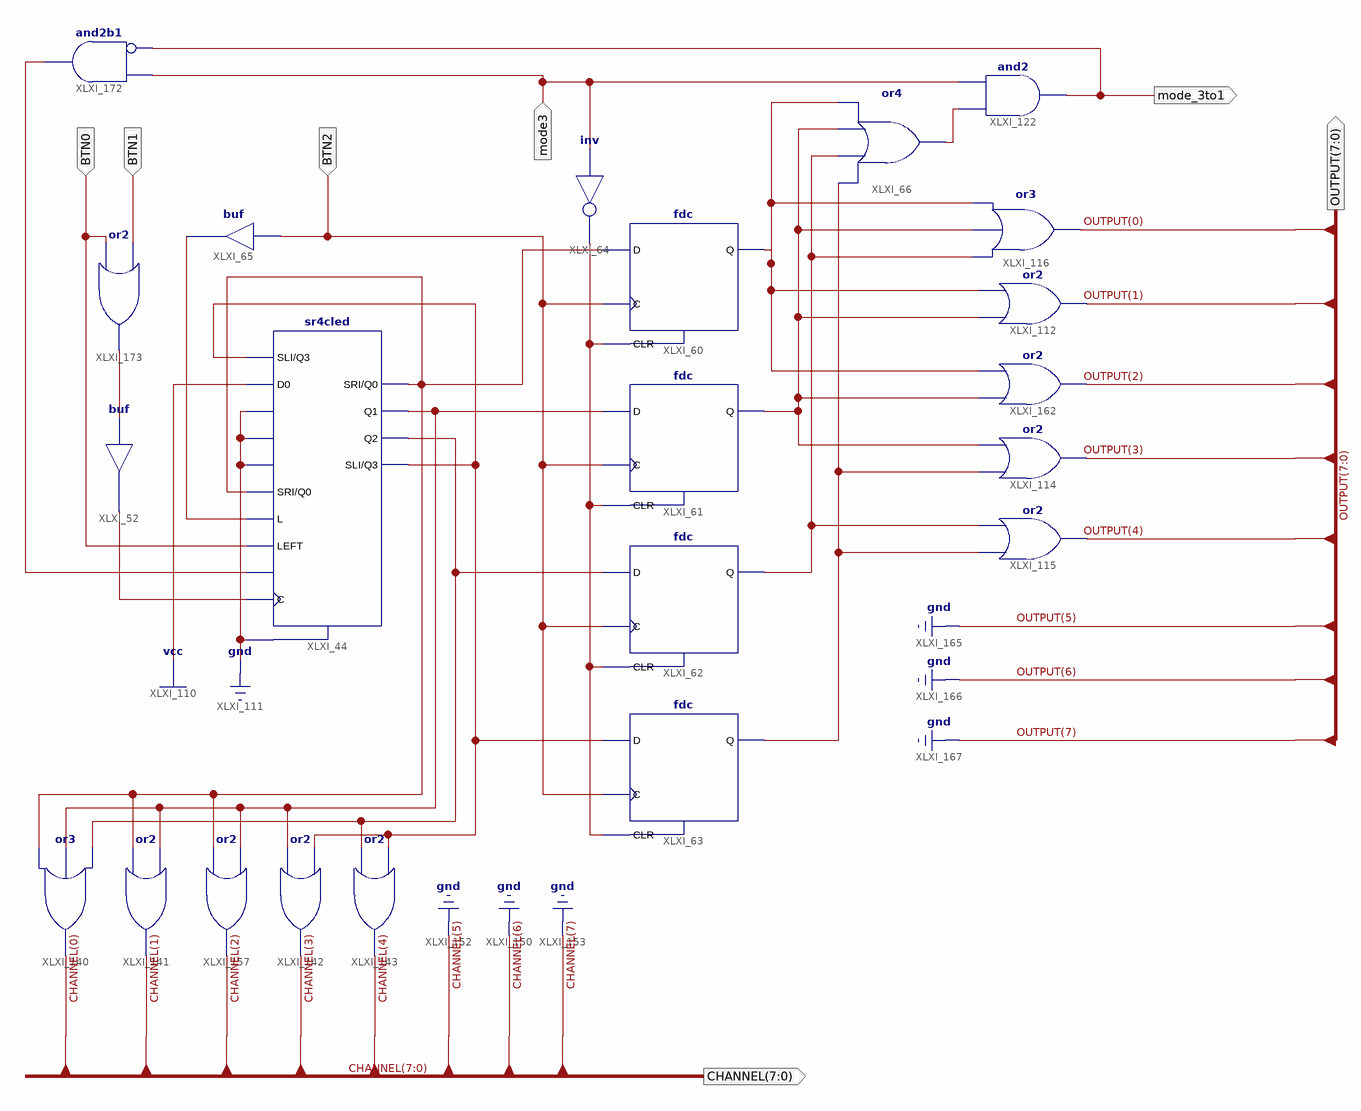
[diagram p0: schematic sheet 1]
// Xilinx ISE schematic third.sch (spartan3) as structural Verilog: 22 symbols, 8 ports
module third (
  input  XLXN_111,
  input  BTN2,
  input  BTN0,
  input  mode3,
  input  BTN1,
  output mode_3to1,
  output [7:0] CHANNEL,
  output [7:0] OUTPUT
);

  wire XLXN_76, XLXN_88, XLXN_122, XLXN_123, XLXN_124, XLXN_125, XLXN_164, XLXN_166, XLXN_170, XLXN_241,
       XLXN_348, XLXN_371;

  buf XLXI_52 (XLXN_88, XLXN_348);
  sr4cled XLXI_44 (
    .C(XLXN_88), .CE(1'b0), .CLR(1'b0), .D0(1'b1), .D1(1'b0), .D2(1'b0), .D3(1'b0), .L(XLXN_371),
    .LEFT(BTN0), .SLI(XLXN_76), .SRI(XLXN_164), .Q0(XLXN_164), .Q1(XLXN_111), .Q2(XLXN_170), .Q3(XLXN_76));
  buf XLXI_65 (XLXN_371, BTN2);
  or XLXI_66 (XLXN_241, XLXN_125, XLXN_124, XLXN_123, XLXN_122);
  not XLXI_64 (XLXN_166, mode3);
  and XLXI_122 (mode_3to1, XLXN_241, mode3);
  or XLXI_116 (OUTPUT[0], XLXN_124, XLXN_123, XLXN_122);
  or XLXI_112 (OUTPUT[1], XLXN_123, XLXN_122);
  fdc XLXI_60 (.C(BTN2), .CLR(XLXN_166), .D(XLXN_164), .Q(XLXN_122));
  fdc XLXI_61 (.C(BTN2), .CLR(XLXN_166), .D(XLXN_111), .Q(XLXN_123));
  fdc XLXI_62 (.C(BTN2), .CLR(XLXN_166), .D(XLXN_170), .Q(XLXN_124));
  fdc XLXI_63 (.C(BTN2), .CLR(XLXN_166), .D(XLXN_76), .Q(XLXN_125));
  or XLXI_140 (CHANNEL[0], XLXN_164, XLXN_111, XLXN_170);
  or XLXI_141 (CHANNEL[1], XLXN_164, XLXN_111);
  or XLXI_143 (CHANNEL[4], XLXN_170, XLXN_76);
  or XLXI_142 (CHANNEL[3], XLXN_111, XLXN_76);
  or XLXI_157 (CHANNEL[2], XLXN_164, XLXN_111);
  or XLXI_162 (OUTPUT[2], XLXN_123, XLXN_122);
  or XLXI_114 (OUTPUT[3], XLXN_125, XLXN_123);
  or XLXI_115 (OUTPUT[4], XLXN_125, XLXN_124);
  // and2b1 XLXI_172 has open pins: I0=mode_3to1, I1=mode3, O=1'b0
  or XLXI_173 (XLXN_348, BTN0, BTN1);

  assign CHANNEL[7:5] = 3'b000;
  assign OUTPUT[7:5] = 3'b000;
endmodule
